# Altium project 武术机器人主控.PrjPcb
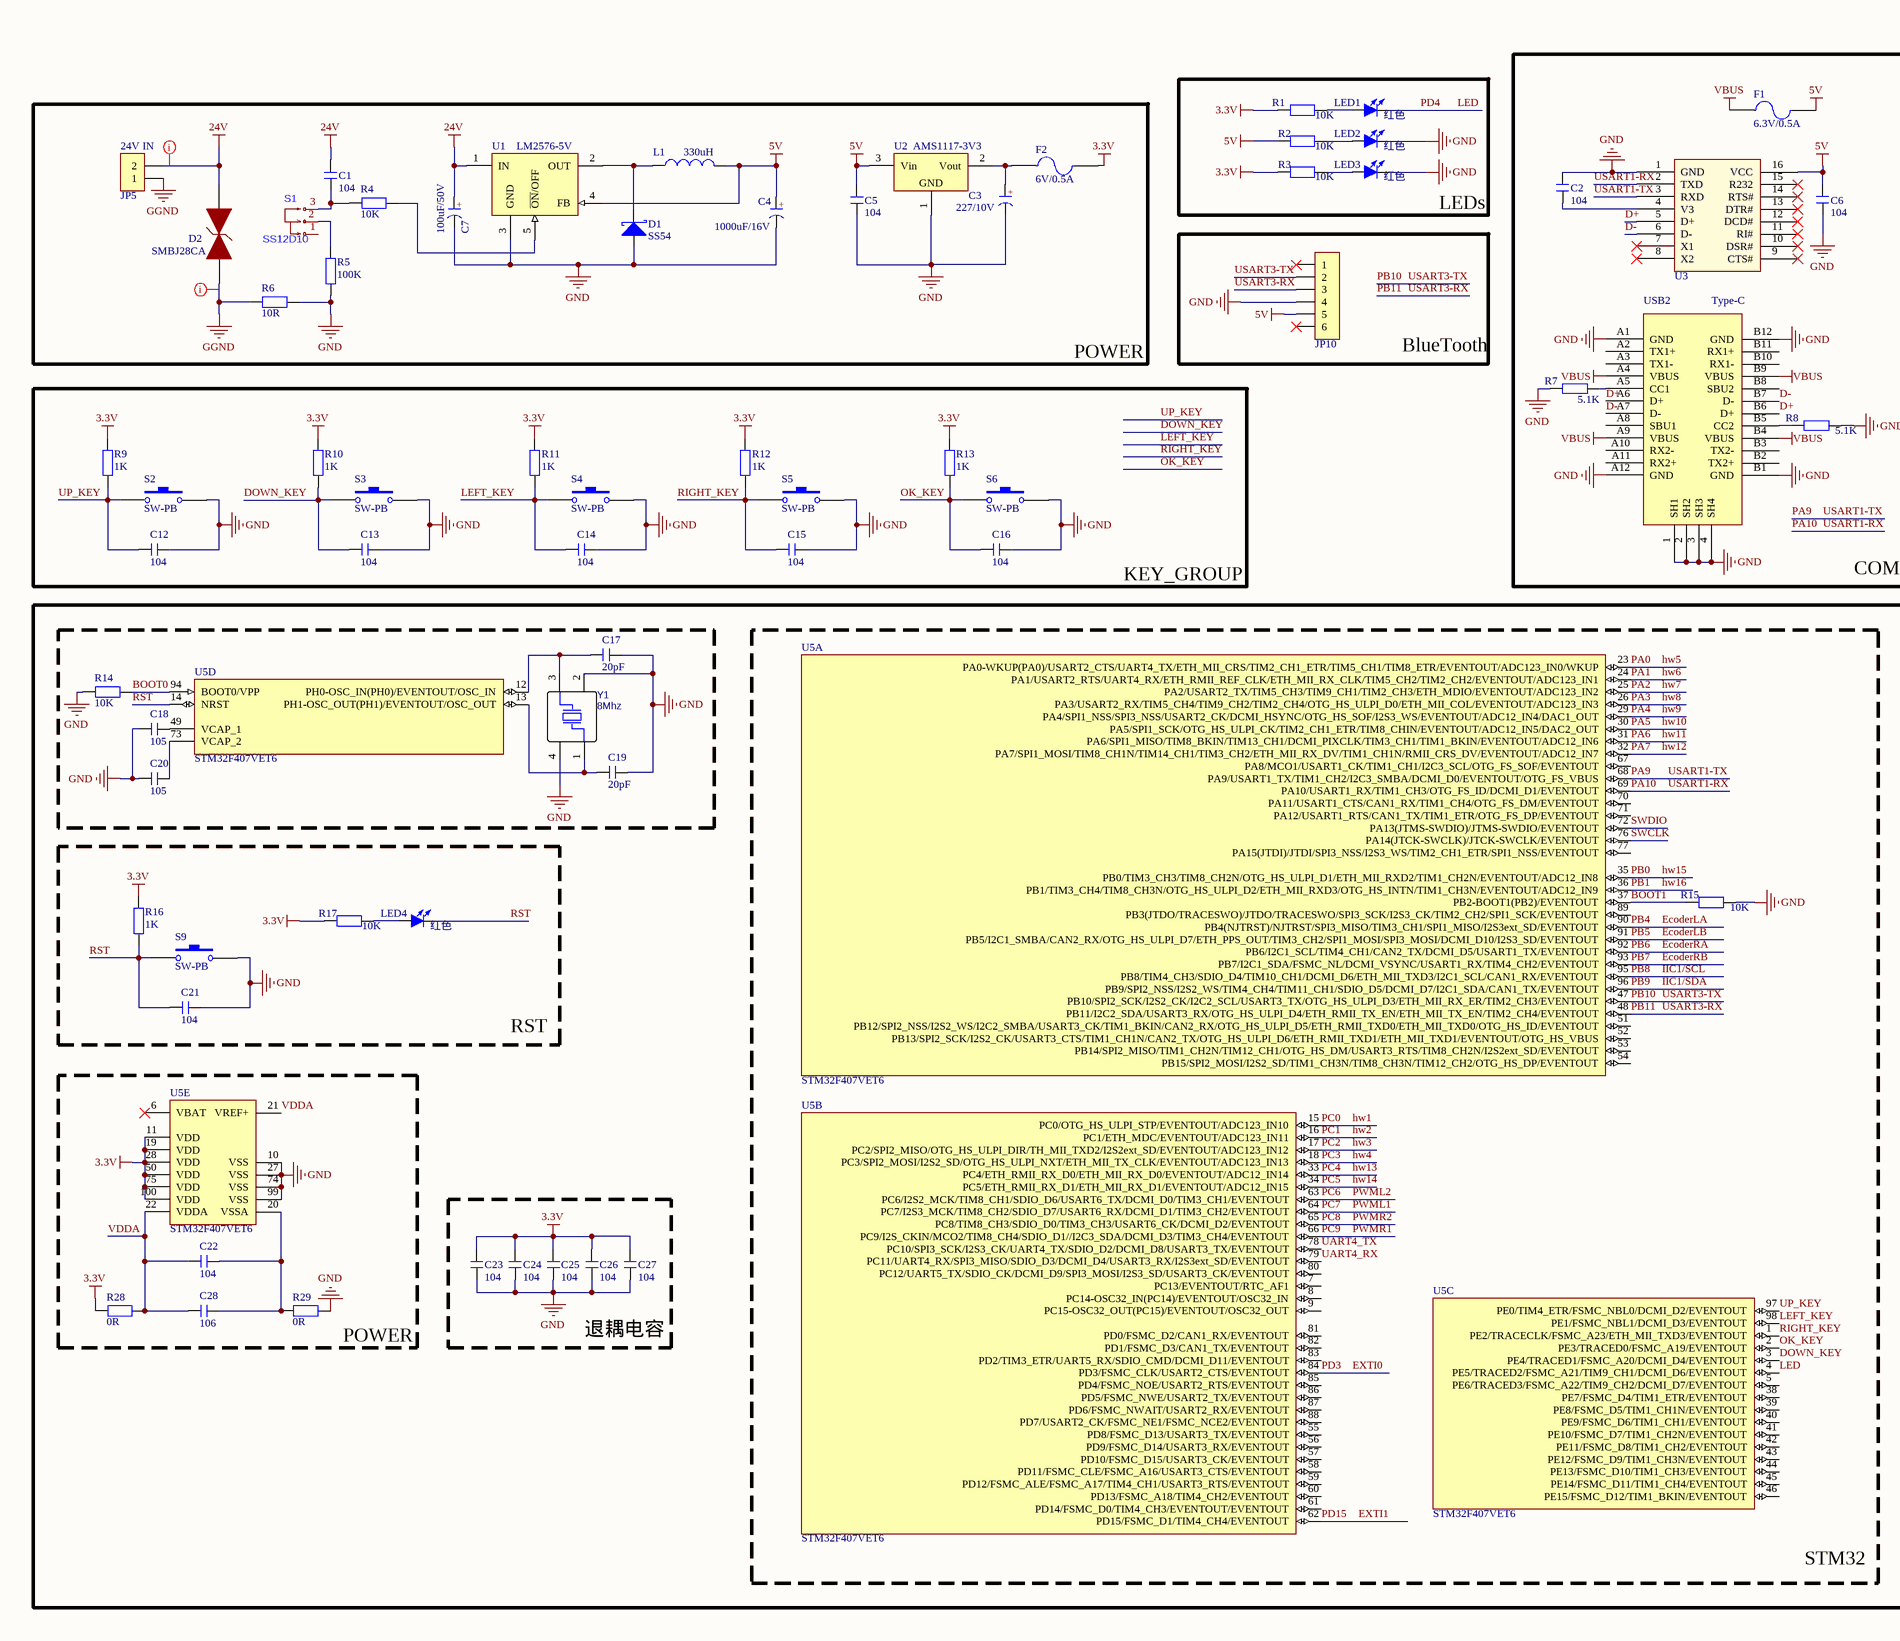
[diagram p0: Schematic.SchDoc, left]
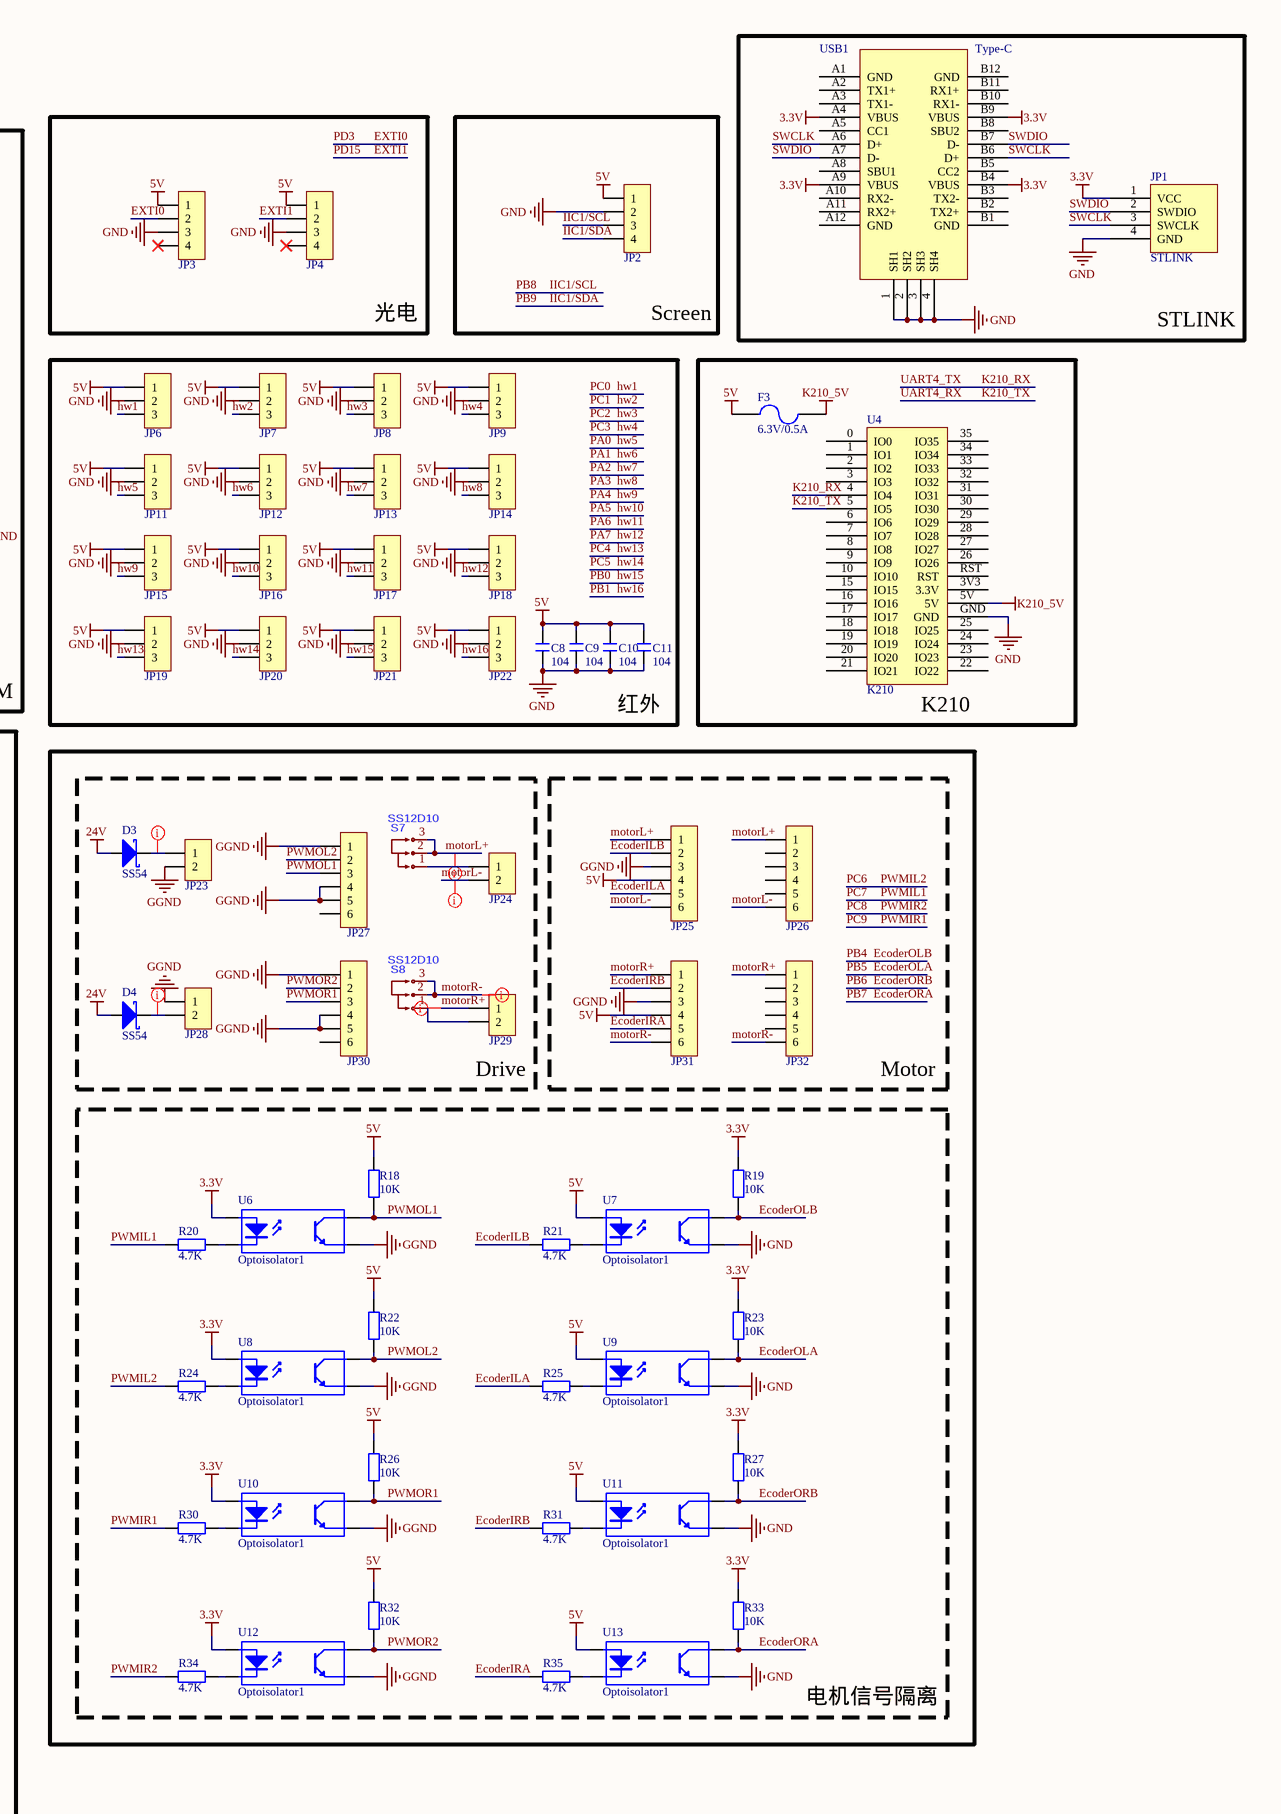
[diagram p1: Schematic.SchDoc, right]
1 sheet, 132 parts. Net scope: global (net labels, ports and power ports of the same name join across sheets).
Board file: PCB.PcbDoc

## Sheet Schematic.SchDoc
size 635 x 355 mm

### Parts
C1  104  [C 0805_L]
C2  104  [C 0805_L]
C3  227/10V  [CM D(6.3*7.7)]
C4  1000uF/16V  [CAP 7.5*16*25 - GD]
C5  104  [C 0805_L]
C6  104  [C 0805_L]
C7  100uF/50V  [CAP 3.5*8*11.5 - GD]
C8  104  [C 0805_L]
C9  104  [C 0805_L]
C10  104  [C 0805_L]
C11  104  [C 0805_L]
C12  104  [C 0805_L]
C13  104  [C 0805_L]
C14  104  [C 0805_L]
C15  104  [C 0805_L]
C16  104  [C 0805_L]
C17  20pF  [C 0805_L]
C18  105  [C 0805_L]
C19  20pF  [C 0805_L]
C20  105  [C 0805_L]
C21  104  [C 0805_L]
C22  104  [C 0805_L]
C23  104  [C 0805_L]
C24  104  [C 0805_L]
C25  104  [C 0805_L]
C26  104  [C 0805_L]
C27  104  [C 0805_L]
C28  106  [C 0805_L]
D1  SS54  [SMB/DO214AA]
D2  SMBJ28CA  [SMB/DO214AA]
D3  SS54  [SMB/DO214AA]
D4  SS54  [SMB/DO214AA]
F1  6.3V/0.5A  [C 0805_L]
F2  6V/0.5A  [R 1206_L]
F3  6.3V/0.5A  [C 0805_L]
JP1  STLINK  [HDR2.54-LI-4P]
JP2  OLED  [OLED_0.96 4P]  (value not drawn)
JP3  光电  [XH2.54-LI-4P]  (value not drawn)
JP4  光电  [XH2.54-LI-4P]  (value not drawn)
JP5  24V IN  [KF128-5.08-2P]
JP6  红外  [PH2.0-LI-3P]  (value not drawn)
JP7  红外  [PH2.0-LI-3P]  (value not drawn)
JP8  红外  [PH2.0-LI-3P]  (value not drawn)
JP9  红外  [PH2.0-LI-3P]  (value not drawn)
JP10  蓝牙  [HDR2.54-LI-6P]  (value not drawn)
JP11  红外  [PH2.0-LI-3P]  (value not drawn)
JP12  红外  [PH2.0-LI-3P]  (value not drawn)
JP13  红外  [PH2.0-LI-3P]  (value not drawn)
JP14  红外  [PH2.0-LI-3P]  (value not drawn)
JP15  红外  [PH2.0-LI-3P]  (value not drawn)
JP16  红外  [PH2.0-LI-3P]  (value not drawn)
JP17  红外  [PH2.0-LI-3P]  (value not drawn)
JP18  红外  [PH2.0-LI-3P]  (value not drawn)
JP19  红外  [PH2.0-LI-3P]  (value not drawn)
JP20  红外  [PH2.0-LI-3P]  (value not drawn)
JP21  红外  [PH2.0-LI-3P]  (value not drawn)
JP22  红外  [PH2.0-LI-3P]  (value not drawn)
JP23  驱动1  [KF128-5.08-2P]  (value not drawn)
JP24  驱动输出1  [KF128-5.08-2P]  (value not drawn)
JP25  电机1  [XH2.54-LI-6P]  (value not drawn)
JP26  电机1p  [XH2.54-LI-6P]  (value not drawn)
JP27  驱动pwm1  [XH2.54-LI-6P]  (value not drawn)
JP28  驱动2  [KF128-5.08-2P]  (value not drawn)
JP29  驱动输出1  [KF128-5.08-2P]  (value not drawn)
JP30  驱动pwm2  [XH2.54-LI-6P]  (value not drawn)
JP31  电机2  [XH2.54-LI-6P]  (value not drawn)
JP32  电机2p  [XH2.54-LI-6P]  (value not drawn)
L1  330uH  [CDRH125]
LED1  红色  [LED 0805G]
LED2  红色  [LED 0805G]
LED3  红色  [LED 0805G]
LED4  红色  [LED 0805G]
R1  10K  [R 0805_L]
R2  10K  [R 0805_L]
R3  10K  [R 0805_L]
R4  10K  [R 0805_L]
R5  100K  [R 0805_L]
R6  10R  [R 0805_L]
R7  5.1K  [R 0805_L]
R8  5.1K  [R 0805_L]
R9  1K  [R 0805_L]
R10  1K  [R 0805_L]
R11  1K  [R 0805_L]
R12  1K  [R 0805_L]
R13  1K  [R 0805_L]
R14  10K  [R 0805_L]
R15  10K  [R 0805_L]
R16  1K  [R 0805_L]
R17  10K  [R 0805_L]
R18  10K  [R 0805_L]
R19  10K  [R 0805_L]
R20  4.7K  [R 0805_L]
R21  4.7K  [R 0805_L]
R22  10K  [R 0805_L]
R23  10K  [R 0805_L]
R24  4.7K  [R 0805_L]
R25  4.7K  [R 0805_L]
R26  10K  [R 0805_L]
R27  10K  [R 0805_L]
R28  0R  [R 0805_L]
R29  0R  [R 0805_L]
R30  4.7K  [R 0805_L]
R31  4.7K  [R 0805_L]
R32  10K  [R 0805_L]
R33  10K  [R 0805_L]
R34  4.7K  [R 0805_L]
R35  4.7K  [R 0805_L]
S1  SS12D10  [SS-12D10]
S2  SW-PB  [TSW SMD-6*6*4.3]
S3  SW-PB  [TSW SMD-6*6*4.3]
S4  SW-PB  [TSW SMD-6*6*4.3]
S5  SW-PB  [TSW SMD-6*6*4.3]
S6  SW-PB  [TSW SMD-6*6*4.3]
S7  SS12D10  [SS-12D10]
S8  SS12D10  [SS-12D10]
S9  SW-PB  [TSW SMD-3*6*2.5]
U1  LM2576-5V  [TO263-5A]
U2  AMS1117-3V3  [SOT223_L]
U3  CH340C  [sop16_L]  (value not drawn)
U4  K210  [K210]
U5  STM32F407VET6  [LQFP100 14x14_M]  (parts A,B,C,D,E of 5)
U6  Optoisolator1  [SOP4-W2.54_M]
U7  Optoisolator1  [SOP4-W2.54_M]
U8  Optoisolator1  [SOP4-W2.54_M]
U9  Optoisolator1  [SOP4-W2.54_M]
U10  Optoisolator1  [SOP4-W2.54_M]
U11  Optoisolator1  [SOP4-W2.54_M]
U12  Optoisolator1  [SOP4-W2.54_M]
U13  Optoisolator1  [SOP4-W2.54_M]
USB1  Type-C  [USBTypeC-16P]
USB2  Type-C  [USBTypeC-16P]
Y1  8Mhz  [OSC 5032-4P]

### Blocks framed on the sheet
STLINK: JP1 USB1
COM: C2 C6 F1 R7 R8 U3 USB2
光电: JP3 JP4
Screen: JP2
POWER: C1 C3-C5 C7 D1 D2 F2 JP5 L1 R4-R6 S1 U1 U2
LEDs: LED1-LED3 R1-R3
BlueTooth: JP10
红外: C8-C11 JP6-JP9 JP11-JP22
K210: F3 U4
KEY_GROUP: C12-C16 R9-R13 S2-S6
STM32: R15 U5
Drive: D3 D4 JP23 JP24 JP27-JP30 S7 S8
Motor: JP25 JP26 JP31 JP32
RST: C21 LED4 R16 R17 S9
电机信号隔离: R18-R27 R30-R35 U6-U13
POWER: C22 C28 R28 R29 U5
退耦电容: C23-C27

### Nets
3.3V: C23.2 C24.2 C25.2 C26.2 C27.2 F2.2 JP1.1(VCC) R1.1 R3.2 R9.1 R10.1 R11.1 R12.1 R13.1 R16.1 R17.1 R19.1 R23.1 R27.1 R28.1 R33.1 U5.11(VDD) U5.19(VDD) U5.28(VDD) U5.50(VDD) U5.75(VDD) U5.100(VDD) U6.1(A) U8.1(A) U10.1(A) U12.1(A) USB1.A4(VBUS) USB1.A9(VBUS) USB1.B4(VBUS) USB1.B9(VBUS)
5V: C4.1(A) C5.2 C6.1 C8.2 C9.2 C10.2 C11.2 F1.2 F3.1 JP2.1 JP3.1 JP4.1 JP6.1 JP7.1 JP8.1 JP9.1 JP10.5 JP11.1 JP12.1 JP13.1 JP14.1 JP15.1 JP16.1 JP17.1 JP18.1 JP19.1 JP20.1 JP21.1 JP22.1 JP25.4 JP31.4 L1.2 R2.2 R18.1 R22.1 R26.1 R32.1 U1.4(FB) U2.3(Vin) U3.16(VCC) U7.1(A) U9.1(A) U11.1(A) U13.1(A)
24V: C1.2 C7.1(A) D2.2 D3.1(A) D4.1(A) JP5.2 U1.1(IN)
GGND: D2.1 JP5.1 JP23.2 JP25.3 JP27.1 JP27.4 JP27.5 JP28.1 JP30.1 JP30.4 JP30.5 JP31.3 R6.2 U6.3(E) U8.3(E) U10.3(E) U12.3(E)
GND: C2.2 C3.2(K) C4.2(K) C5.1 C6.2 C7.2(K) C8.1 C9.1 C10.1 C11.1 C12.2 C13.2 C14.2 C15.2 C16.2 C17.2 C18.1 C19.2 C20.1 C21.2 C23.1 C24.1 C25.1 C26.1 C27.1 D1.1(A) JP1.4(GND) JP2.2 JP3.3 JP4.3 JP6.2 JP7.2 JP8.2 JP9.2 JP10.4 JP11.2 JP12.2 JP13.2 JP14.2 JP15.2 JP16.2 JP17.2 JP18.2 JP19.2 JP20.2 JP21.2 JP22.2 LED2.2(K) LED3.2(K) R5.1 R6.1 R7.1 R8.2 R14.1 R15.1 R29.2 S2.2 S3.2 S4.2 S5.2 S6.2 S9.2 U1.3(GND) U2.1(GND) U3.1(GND) U4.GND U5.10(VSS) U5.27(VSS) U5.74(VSS) U5.99(VSS) U7.3(E) U9.3(E) U11.3(E) U13.3(E) USB1.1(SH1) USB1.2(SH2) USB1.3(SH3) USB1.4(SH4) USB2.1(SH1) USB2.2(SH2) USB2.3(SH3) USB2.4(SH4) USB2.A1(GND) USB2.A12(GND) USB2.B1(GND) USB2.B12(GND) Y1.2(GND) Y1.4(GND)
K210_5V: F3.2 U4.5V
VBUS: F1.1 USB2.A4(VBUS) USB2.A9(VBUS) USB2.B4(VBUS) USB2.B9(VBUS)
BOOT0: R14.2 U5.94(BOOT0/VPP)
BOOT1: R15.2 U5.37(PB2-BOOT1(PB2)/EVENTOUT)
D+: U3.5(D+) USB2.A6(D+) USB2.B6(D+)
D-: U3.6(D-) USB2.A7(D-) USB2.B7(D-)
DOWN_KEY: C13.1 R10.2 S3.1 U5.3(PE4/TRACED1/FSMC_A20/DCMI_D4/EVENTOUT)
EcoderILA: JP25.5 R25.1
EcoderILB: JP25.2 R21.1
EcoderIRA: JP31.5 R35.1
EcoderIRB: JP31.2 R31.1
EcoderLA: R19.2 U5.90(PB4(NJTRST)/NJTRST/SPI3_MISO/TIM3_CH1/SPI1_MISO/I2S3ext_SD/EVENTOUT) U7.4(C)  [also labelled EcoderOLB, PB4]
EcoderLB: R23.2 U5.91(PB5/I2C1_SMBA/CAN2_RX/OTG_HS_ULPI_D7/ETH_PPS_OUT/TIM3_CH2/SPI1_MOSI/SPI3_MOSI/DCMI_D10/I2S3_SD/EVENTOUT) U9.4(C)  [also labelled EcoderOLA, PB5]
EcoderORA: R33.2 U5.93(PB7/I2C1_SDA/FSMC_NL/DCMI_VSYNC/USART1_RX/TIM4_CH2/EVENTOUT) U13.4(C)  [also labelled EcoderRB, PB7]
EcoderORB: R27.2 U5.92(PB6/I2C1_SCL/TIM4_CH1/CAN2_TX/DCMI_D5/USART1_TX/EVENTOUT) U11.4(C)  [also labelled EcoderRA, PB6]
EXTI0: JP3.2 U5.84(PD3/FSMC_CLK/USART2_CTS/EVENTOUT)  [also labelled PD3]
EXTI1: JP4.2 U5.62(PD15/FSMC_D1/TIM4_CH4/EVENTOUT)  [also labelled PD15]
hw1: JP6.3 U5.15(PC0/OTG_HS_ULPI_STP/EVENTOUT/ADC123_IN10)  [also labelled PC0]
hw2: JP7.3 U5.16(PC1/ETH_MDC/EVENTOUT/ADC123_IN11)  [also labelled PC1]
hw3: JP8.3 U5.17(PC2/SPI2_MISO/OTG_HS_ULPI_DIR/TH_MII_TXD2/I2S2ext_SD/EVENTOUT/ADC123_IN12)  [also labelled PC2]
hw4: JP9.3 U5.18(PC3/SPI2_MOSI/I2S2_SD/OTG_HS_ULPI_NXT/ETH_MII_TX_CLK/EVENTOUT/ADC123_IN13)  [also labelled PC3]
hw5: JP11.3 U5.23(PA0-WKUP(PA0)/USART2_CTS/UART4_TX/ETH_MII_CRS/TIM2_CH1_ETR/TIM5_CH1/TIM8_ETR/EVENTOUT/ADC123_IN0/WKUP)  [also labelled PA0]
hw6: JP12.3 U5.24(PA1/USART2_RTS/UART4_RX/ETH_RMII_REF_CLK/ETH_MII_RX_CLK/TIM5_CH2/TIM2_CH2/EVENTOUT/ADC123_IN1)  [also labelled PA1]
hw7: JP13.3 U5.25(PA2/USART2_TX/TIM5_CH3/TIM9_CH1/TIM2_CH3/ETH_MDIO/EVENTOUT/ADC123_IN2)  [also labelled PA2]
hw8: JP14.3 U5.26(PA3/USART2_RX/TIM5_CH4/TIM9_CH2/TIM2_CH4/OTG_HS_ULPI_D0/ETH_MII_COL/EVENTOUT/ADC123_IN3)  [also labelled PA3]
hw9: JP15.3 U5.29(PA4/SPI1_NSS/SPI3_NSS/USART2_CK/DCMI_HSYNC/OTG_HS_SOF/I2S3_WS/EVENTOUT/ADC12_IN4/DAC1_OUT)  [also labelled PA4]
hw10: JP16.3 U5.30(PA5/SPI1_SCK/OTG_HS_ULPI_CK/TIM2_CH1_ETR/TIM8_CHIN/EVENTOUT/ADC12_IN5/DAC2_OUT)  [also labelled PA5]
hw11: JP17.3 U5.31(PA6/SPI1_MISO/TIM8_BKIN/TIM13_CH1/DCMI_PIXCLK/TIM3_CH1/TIM1_BKIN/EVENTOUT/ADC12_IN6)  [also labelled PA6]
hw12: JP18.3 U5.32(PA7/SPI1_MOSI/TIM8_CH1N/TIM14_CH1/TIM3_CH2/ETH_MII_RX_DV/TIM1_CH1N/RMII_CRS_DV/EVENTOUT/ADC12_IN7)  [also labelled PA7]
hw13: JP19.3 U5.33(PC4/ETH_RMII_RX_D0/ETH_MII_RX_D0/EVENTOUT/ADC12_IN14)  [also labelled PC4]
hw14: JP20.3 U5.34(PC5/ETH_RMII_RX_D1/ETH_MII_RX_D1/EVENTOUT/ADC12_IN15)  [also labelled PC5]
hw15: JP21.3 U5.35(PB0/TIM3_CH3/TIM8_CH2N/OTG_HS_ULPI_D1/ETH_MII_RXD2/TIM1_CH2N/EVENTOUT/ADC12_IN8)  [also labelled PB0]
hw16: JP22.3 U5.36(PB1/TIM3_CH4/TIM8_CH3N/OTG_HS_ULPI_D2/ETH_MII_RXD3/OTG_HS_INTN/TIM1_CH3N/EVENTOUT/ADC12_IN9)  [also labelled PB1]
IIC1/SCL: JP2.3 U5.95(PB8/TIM4_CH3/SDIO_D4/TIM10_CH1/DCMI_D6/ETH_MII_TXD3/I2C1_SCL/CAN1_RX/EVENTOUT)  [also labelled PB8]
IIC1/SDA: JP2.4 U5.96(PB9/SPI2_NSS/I2S2_WS/TIM4_CH4/TIM11_CH1/SDIO_D5/DCMI_D7/I2C1_SDA/CAN1_TX/EVENTOUT)  [also labelled PB9]
K210_RX: U4.4(IO4) U5.78(PC10/SPI3_SCK/I2S3_CK/UART4_TX/SDIO_D2/DCMI_D8/USART3_TX/EVENTOUT)  [also labelled UART4_TX]
K210_TX: U4.5(IO5) U5.79(PC11/UART4_RX/SPI3_MISO/SDIO_D3/DCMI_D4/USART3_RX/I2S3ext_SD/EVENTOUT)  [also labelled UART4_RX]
LED: LED1.2(K) U5.4(PE5/TRACED2/FSMC_A21/TIM9_CH1/DCMI_D6/EVENTOUT)  [also labelled PD4]
LEFT_KEY: C14.1 R11.2 S4.1 U5.98(PE1/FSMC_NBL1/DCMI_D3/EVENTOUT)
motorL+: JP25.1 JP26.1 S7.2 S7.3
motorL-: JP24.2 JP25.6 JP26.6
motorR+: JP29.1 JP31.1 JP32.1
motorR-: JP31.6 JP32.6 S8.2 S8.3
OK_KEY: C16.1 R13.2 S6.1 U5.2(PE3/TRACED0/FSMC_A19/EVENTOUT)
PA9: U3.3(RXD) U5.68(PA9/USART1_TX/TIM1_CH2/I2C3_SMBA/DCMI_D0/EVENTOUT/OTG_FS_VBUS)  [also labelled USART1-TX]
PA10: U3.2(TXD) U5.69(PA10/USART1_RX/TIM1_CH3/OTG_FS_ID/DCMI_D1/EVENTOUT)  [also labelled USART1-RX]
PB10: JP10.2 U5.47(PB10/SPI2_SCK/I2S2_CK/I2C2_SCL/USART3_TX/OTG_HS_ULPI_D3/ETH_MII_RX_ER/TIM2_CH3/EVENTOUT)  [also labelled USART3-TX]
PB11: JP10.3 U5.48(PB11/I2C2_SDA/USART3_RX/OTG_HS_ULPI_D4/ETH_RMII_TX_EN/ETH_MII_TX_EN/TIM2_CH4/EVENTOUT)  [also labelled USART3-RX]
PC6: R24.1 U5.63(PC6/I2S2_MCK/TIM8_CH1/SDIO_D6/USART6_TX/DCMI_D0/TIM3_CH1/EVENTOUT)  [also labelled PWMIL2, PWML2]
PC7: R20.1 U5.64(PC7/I2S3_MCK/TIM8_CH2/SDIO_D7/USART6_RX/DCMI_D1/TIM3_CH2/EVENTOUT)  [also labelled PWMIL1, PWML1]
PC8: R34.1 U5.65(PC8/TIM8_CH3/SDIO_D0/TIM3_CH3/USART6_CK/DCMI_D2/EVENTOUT)  [also labelled PWMIR2, PWMR2]
PC9: R30.1 U5.66(PC9/I2S_CKIN/MCO2/TIM8_CH4/SDIO_D1//I2C3_SDA/DCMI_D3/TIM3_CH4/EVENTOUT)  [also labelled PWMIR1, PWMR1]
PWMOL1: JP27.3 R18.2 U6.4(C)
PWMOL2: JP27.2 R22.2 U8.4(C)
PWMOR1: JP30.3 R26.2 U10.4(C)
PWMOR2: JP30.2 R32.2 U12.4(C)
RIGHT_KEY: C15.1 R12.2 S5.1 U5.1(PE2/TRACECLK/FSMC_A23/ETH_MII_TXD3/EVENTOUT)
RST: C21.1 LED4.2(K) R16.2 S9.1 U5.14(NRST)
SWCLK: JP1.3(SWCLK) U5.76(PA14(JTCK-SWCLK)/JTCK-SWCLK/EVENTOUT) USB1.A6(D+) USB1.B6(D+)
SWDIO: JP1.2(SWDIO) U5.72(PA13(JTMS-SWDIO)/JTMS-SWDIO/EVENTOUT) USB1.A7(D-) USB1.B7(D-)
UP_KEY: C12.1 R9.2 S2.1 U5.97(PE0/TIM4_ETR/FSMC_NBL0/DCMI_D2/EVENTOUT)
VDDA: C22.1 C28.1 R28.2 U5.21(VREF+) U5.22(VDDA)
NetC1_1: C1.1 R4.2 S1.3
NetC2_1: C2.1 U3.4(V3)
NetC3_1: C3.1(A) F2.1 U2.2(Vout)
NetC17_1: C17.1 U5.12(PH0-OSC_IN(PH0)/EVENTOUT/OSC_IN) Y1.3(OSC2)
NetC18_2: C18.2 U5.49(VCAP_1)
NetC19_1: C19.1 U5.13(PH1-OSC_OUT(PH1)/EVENTOUT/OSC_OUT) Y1.1(OSC1)
NetC20_2: C20.2 U5.73(VCAP_2)
NetC22_2: C22.2 C28.2 R29.1 U5.20(VSSA)
NetD1_2: D1.2(K) L1.1 U1.2(OUT)
NetD3_2: D3.2(K) JP23.1
NetD4_2: D4.2(K) JP28.2
NetJP24_1: JP24.1 S7.1
NetJP29_2: JP29.2 S8.1
NetLED1_1: LED1.1(A) R1.2
NetLED2_1: LED2.1(A) R2.1
NetLED3_1: LED3.1(A) R3.1
NetLED4_1: LED4.1(A) R17.2
NetR4_1: R4.1 U1.5(~{ON}/OFF)
NetR5_2: R5.2 S1.2
NetR7_2: R7.2 USB2.A5(CC1)
NetR8_1: R8.1 USB2.B5(CC2)
NetR20_2: R20.2 U6.2(K)
NetR21_2: R21.2 U7.2(K)
NetR24_2: R24.2 U8.2(K)
NetR25_2: R25.2 U9.2(K)
NetR30_2: R30.2 U10.2(K)
NetR31_2: R31.2 U11.2(K)
NetR34_2: R34.2 U12.2(K)
NetR35_2: R35.2 U13.2(K)

Not connected (* = marked no-connect by the designer): JP3 4*; JP4 4*; JP10 1* 6*; JP26 2 3 4 5; JP27 6; JP30 6; JP32 2 3 4 5; S1 1; U3 7(X1)* 8(X2)* 9(CTS#)* 10(DSR#)* 11(RI#)* 12(DCD#)* 13(DTR#)* 14(RTS#)* 15(R232)*; U4 0(IO0) 1(IO1) 2(IO2) 3(IO3) 3V3(3.3V) 6(IO6) 7(IO7) 8(IO8) 9(IO9) 10(IO10) 15(IO15) 16(IO16) 17(IO17) 18(IO18) 19(IO19) 20(IO20) 21(IO21) 22(IO22) 23(IO23) 24(IO24) 25(IO25) 26(IO26) 27(IO27) 28(IO28) 29(IO29) 30(IO30) 31(IO31) 32(IO32) 33(IO33) 34(IO34) 35(IO35) RST; U5 5(PE6/TRACED3/FSMC_A22/TIM9_CH2/DCMI_D7/EVENTOUT) 6(VBAT)* 7(PC13/EVENTOUT/RTC_AF1) 8(PC14-OSC32_IN(PC14)/EVENTOUT/OSC32_IN) 9(PC15-OSC32_OUT(PC15)/EVENTOUT/OSC32_OUT) 38(PE7/FSMC_D4/TIM1_ETR/EVENTOUT) 39(PE8/FSMC_D5/TIM1_CH1N/EVENTOUT) 40(PE9/FSMC_D6/TIM1_CH1/EVENTOUT) 41(PE10/FSMC_D7/TIM1_CH2N/EVENTOUT) 42(PE11/FSMC_D8/TIM1_CH2/EVENTOUT) 43(PE12/FSMC_D9/TIM1_CH3N/EVENTOUT) 44(PE13/FSMC_D10/TIM1_CH3/EVENTOUT) 45(PE14/FSMC_D11/TIM1_CH4/EVENTOUT) 46(PE15/FSMC_D12/TIM1_BKIN/EVENTOUT) 51(PB12/SPI2_NSS/I2S2_WS/I2C2_SMBA/USART3_CK/TIM1_BKIN/CAN2_RX/OTG_HS_ULPI_D5/ETH_RMII_TXD0/ETH_MII_TXD0/OTG_HS_ID/EVENTOUT) 52(PB13/SPI2_SCK/I2S2_CK/USART3_CTS/TIM1_CH1N/CAN2_TX/OTG_HS_ULPI_D6/ETH_RMII_TXD1/ETH_MII_TXD1/EVENTOUT/OTG_HS_VBUS) 53(PB14/SPI2_MISO/TIM1_CH2N/TIM12_CH1/OTG_HS_DM/USART3_RTS/TIM8_CH2N/I2S2ext_SD/EVENTOUT) 54(PB15/SPI2_MOSI/I2S2_SD/TIM1_CH3N/TIM8_CH3N/TIM12_CH2/OTG_HS_DP/EVENTOUT) 55(PD8/FSMC_D13/USART3_TX/EVENTOUT) 56(PD9/FSMC_D14/USART3_RX/EVENTOUT) 57(PD10/FSMC_D15/USART3_CK/EVENTOUT) 58(PD11/FSMC_CLE/FSMC_A16/USART3_CTS/EVENTOUT) 59(PD12/FSMC_ALE/FSMC_A17/TIM4_CH1/USART3_RTS/EVENTOUT) 60(PD13/FSMC_A18/TIM4_CH2/EVENTOUT) 61(PD14/FSMC_D0/TIM4_CH3/EVENTOUT/EVENTOUT) 67(PA8/MCO1/USART1_CK/TIM1_CH1/I2C3_SCL/OTG_FS_SOF/EVENTOUT) 70(PA11/USART1_CTS/CAN1_RX/TIM1_CH4/OTG_FS_DM/EVENTOUT) 71(PA12/USART1_RTS/CAN1_TX/TIM1_ETR/OTG_FS_DP/EVENTOUT) 77(PA15(JTDI)/JTDI/SPI3_NSS/I2S3_WS/TIM2_CH1_ETR/SPI1_NSS/EVENTOUT) 80(PC12/UART5_TX/SDIO_CK/DCMI_D9/SPI3_MOSI/I2S3_SD/USART3_CK/EVENTOUT) 81(PD0/FSMC_D2/CAN1_RX/EVENTOUT) 82(PD1/FSMC_D3/CAN1_TX/EVENTOUT) 83(PD2/TIM3_ETR/UART5_RX/SDIO_CMD/DCMI_D11/EVENTOUT) 85(PD4/FSMC_NOE/USART2_RTS/EVENTOUT) 86(PD5/FSMC_NWE/USART2_TX/EVENTOUT) 87(PD6/FSMC_NWAIT/USART2_RX/EVENTOUT) 88(PD7/USART2_CK/FSMC_NE1/FSMC_NCE2/EVENTOUT) 89(PB3(JTDO/TRACESWO)/JTDO/TRACESWO/SPI3_SCK/I2S3_CK/TIM2_CH2/SPI1_SCK/EVENTOUT); USB1 A1(GND) A2(TX1+) A3(TX1-) A5(CC1) A8(SBU1) A10(RX2-) A11(RX2+) A12(GND) B1(GND) B2(TX2+) B3(TX2-) B5(CC2) B8(SBU2) B10(RX1-) B11(RX1+) B12(GND); USB2 A2(TX1+) A3(TX1-) A8(SBU1) A10(RX2-) A11(RX2+) B2(TX2+) B3(TX2-) B8(SBU2) B10(RX1-) B11(RX1+)

### Layout directives
net class special: 24V, GGND, motorL+, motorL-, motorR+, motorR-, NetD3_2, NetD4_2

### Notes on the sheet
- (in symbol CE) +
- (in symbol CS) +
- (in symbol CT) +

### Library data of the parts
C1 C12-C22 C28 = C: 贴片电容; BOM名称: 无极性贴片电容; 淘宝ID: 封装库来自淘宝 ID：黄晶宝石; 联系售后，技术支持: https://shop463601444.taobao.com; 唯一出售店铺网址: https://shop463601444.taobao.com
C2 C6 C8-C11 = C: BOM名称: 无极性贴片电容; 淘宝ID: 封装库来自淘宝 ID：黄晶宝石; 联系售后，技术支持: https://shop463601444.taobao.com; 唯一出售店铺网址: https://shop463601444.taobao.com
C3 = CT: 贴片钽电容; 淘宝ID: 封装库来自淘宝 ID：黄晶宝石; BOM名称: 贴片钽电容; 联系售后: https://shop463601444.taobao.com
C4 = CE: 直插电解电容; 淘宝ID: 封装库来自淘宝 ID：黄晶宝石; BOM名称: 直插电解电容; 联系售后: https://shop463601444.taobao.com
C5 C23-C27 = C: 无极性贴片电容; 版权归属: 源创客; BOM名称: 无极性贴片电容; 学习资源: www.ooocke.com
C7 = CS: 直插固态电容; 版权归属: 封装库来自淘宝 ID：黄晶宝石; BOM名称: 直插固态电容; 联系售后: https://shop463601444.taobao.com
D1 D3 D4 = 1N5824: 肖特基二极管  30V/5A; 淘宝ID: 封装库来自淘宝 ID：黄晶宝石; 属性: 40V/2A; BOM名称: 肖特基二极管; 欢迎光临: https://shop463601444.taobao.com
F1-F3 = Fuse 2: Fuse; Published: 8-Jun-2000; LatestRevisionDate: 17-Jul-2002; LatestRevisionNote: Re-released for DXP Platform.; PackageReference: PIN-W2/E2.8; Publisher: Altium Limited; PackageDescription: Thru-Hole; 2 Leads
JP2 = Header 4: BOM名称: 4P接插件; 淘宝ID: 小糖豆的小窝窝; 下单链接: https://item.taobao.com/item.htm?ft=t&id=613637044352
JP3 JP4 = Header 4: 4P接插件; 淘宝ID: 小糖豆的小窝窝; BOM名称: 4P接插件; 下单链接: https://item.taobao.com/item.htm?ft=t&id=613637044352
JP5 JP23 JP24 JP28 JP29 = Header 2: 2P接插件; 版权归属: 封装库来自淘宝卖家 ID：黄晶宝石; BOM名称: 2P接插件; 学习资源: https://shop463601444.taobao.com
JP6-JP9 JP11-JP22 = Header 3: 3P接插件; 版权归属: 源创客; BOM名称: 3P接插件; 学习资源: www.ooocke.com
JP10 JP26 JP32 = Header 6: 6P接插件; 淘宝ID: 小糖豆的小窝窝; BOM名称: 6P接插件; 下单链接: https://item.taobao.com/item.htm?ft=t&id=613637044352
JP25 JP27 JP30 JP31 = Header 6: 6P接插件; 版权归属: 封装库来自淘宝 ID：黄晶宝石; BOM名称: 6P接插件; 学习资源: https://shop463601444.taobao.com
L1 = 电感直插: Inductor; Code_IEC: 1005; Published: 8-Jun-2000; LatestRevisionDate: 29-May-2009; LatestRevisionNote: IPC-7351 Footprint Added.; PackageReference: 0402-A; Publisher: Altium Limited; PackageDescription: Chip Inductor; Code_JEITA: 0402
LED1-LED4 = LED-SMD: 贴片LED; 版权归属: 封装库来自淘宝 ID：黄晶宝石; BOM名称: 贴片LED; 学习资源: https://shop463601444.taobao.com
R1-R6 R9-R17 R28 R29 = R: 贴片电阻; 版权归属: 来自淘宝 ID：黄晶宝石; 封装库来自淘宝卖家 ID：黄晶宝石: 其他店铺购入均为盗版，不享受售后技术支持服务，请立即申请退款; BOM名称: 贴片电阻; 联系售后: https://shop463601444.taobao.com
R7 R8 = R
R18-R27 R30-R35 = Res2: Resistor; Published: 8-Jun-2000; LatestRevisionDate: 17-Jul-2002; LatestRevisionNote: Re-released for DXP Platform.; PackageReference: AXIAL-0.4; Publisher: Altium Limited; PackageDescription: Axial Device, Thru-Hole; 2 Leads; 0.4 in Pin Spacing
S1 S7 S8 = SS12D10G4 071
S2-S6 S9 = SW-PB: 微动开关; Published: 24-Mar-1999; LatestRevisionDate: 17-Jul-2002; LatestRevisionNote: Re-released for DXP Platform.; PackageReference: SPST-2; Publisher: Altium Limited
U1 = LM2596-ADJ: DC降压芯片; BOM名称: DC稳压芯片; 淘宝ID: 封装库来自淘宝 ID：黄晶宝石; 学习资源: https://shop463601444.taobao.com
U2 = AMS1117: 三端稳压芯片; BOM名称: 稳压芯片; 淘宝ID: 封装库来自淘宝 ID：黄晶宝石; 欢迎光临淘宝店铺: https://shop463601444.taobao.com
U3 = CH340G: 技术支持，联系售后: 封装库来自淘宝卖家 ID：黄晶宝石; 唯一出售店铺网址: https://shop463601444.taobao.com
U5 = STM32F407VET6: ARM Cortex-M4 32b MCU+FPU, 210DMIP, 512 kB Flash, 192+4 kB RAM, Camera, 82 I/Os, 100-pin LQFP, -40 to +85癈, Tray; Internal RAM: 192kB; Operating Frequency (Processor Speed): 168MHz; A/D Converter: 16x12-bit; D/A Converter: 2x12-bit; 16-bit Timers (IC/OC/PWM): 12x16-bit(24/24/30); 32-bit Timer (IC/OC/PWM): 2x32-bit (8/8/8); Other Timer Functions: 2xWDG, RTC, 24-bit down counter; Serial Interface: 3xSPI/2xI2S/2xI2C/3xUSART(IrDa, ISO7816)/3xUART/2xUSB OTG FS/HS, 2xCAN/Ethernet MAC10/100, SDIO; DatasheetVersion: rev2, Jan-2012; PackageVersion: 2012; PackageReference: LQFP100; PackageDescription: 100-Pin Low Profile Quad Flat Package, 14x14 mm Body, 0.5 mm Pitch; ComponentLink1Description: Manufacturer URL; ComponentLink1URL: http://www.st.com/; ComponentLink2Description: STM32F405/7 Datasheet; ComponentLink2URL: http://www.st.com/internet/com/TECHNICAL_RESOURCES/TECHNICAL_LITERATURE/DATASHEET/DM00037051.pdf; ComponentLink3Description: STM32F4 Web Page; ComponentLink3URL: http://www.st.com/internet/mcu/subclass/1521.jsp
U6-U13 = Optoisolator1: 光耦隔离; Published: 24-Mar-1999; LatestRevisionDate: 04-Mar-2005; LatestRevisionNote: Sch pins 3 & 4 Swapped.; DatasheetVersion: Nov-2003; PackageReference: DIP-4; Publisher: Altium Limited
USB1 USB2 = USB-Type-C-TOP
Y1 = Y: BOM_Manufacturer: YXC; BOM_Manufacturer Part: X322516MLB4SI; nameAlias: Frequency; BOM_Supplier: LCSC; BOM_Supplier Part: C13738; BOM_JLCPCB Part Class: Basic Part; spicePre: X; spiceSymbolName: X322516MLB4SI